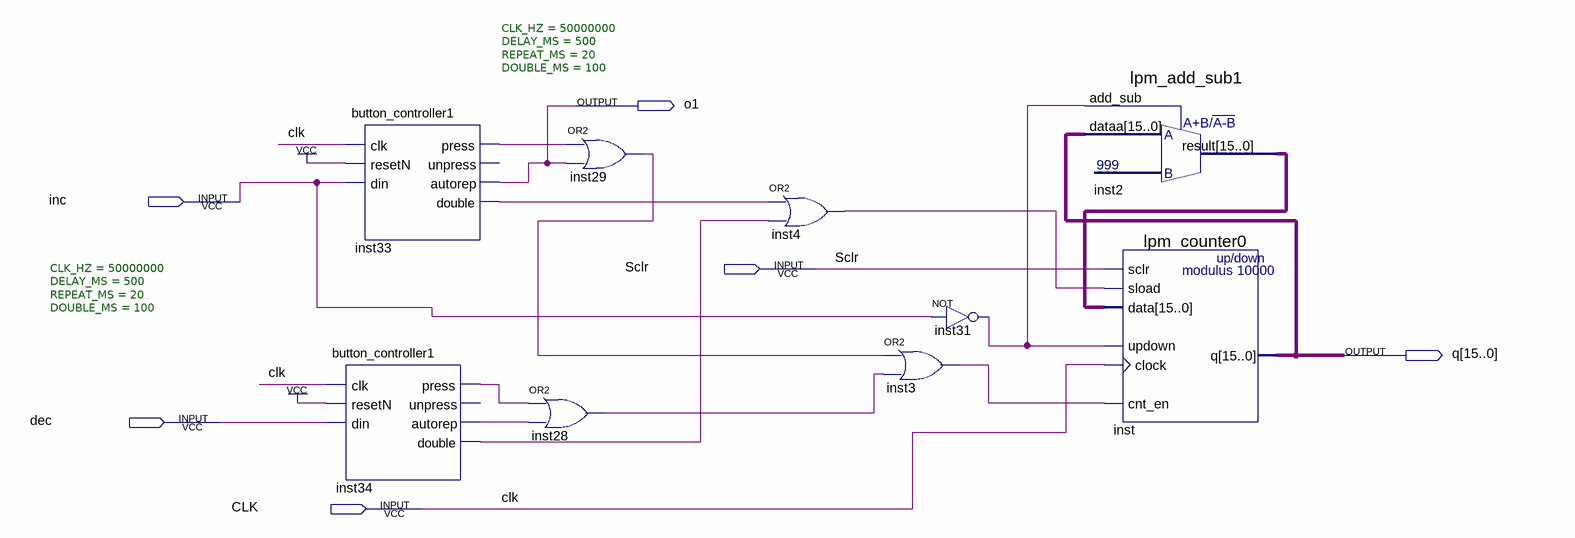
[diagram p0: schematic sheet]
// Quartus schematic increment.bdf as structural Verilog: 9 symbols, 6 pins
module increment (
  input  inc,
  input  Sclr,
  input  dec,
  input  CLK,
  output o1,
  output [15:0] q
);

  wire inst3_out, inst4_out, inst28_out, inst29_out, inst31_out, inst33_double, inst33_press, inst34_autorep,
       inst34_double, inst34_press;
  wire [15:0] inst2_result;

  button_controller1 #(.CLK_HZ(50000000), .DELAY_MS(500), .REPEAT_MS(20), .DOUBLE_MS(100)) inst33 (
    .clk(CLK), .resetN(1'b1), .din(inc), .press(inst33_press), .autorep(o1), .double(inst33_double));  // open: unpress
  button_controller1 #(.CLK_HZ(50000000), .DELAY_MS(500), .REPEAT_MS(20), .DOUBLE_MS(100)) inst34 (
    .clk(CLK), .resetN(1'b1), .din(dec), .press(inst34_press), .autorep(inst34_autorep),
    .double(inst34_double));  // open: unpress
  or inst29 (inst29_out, inst33_press, o1);
  or inst28 (inst28_out, inst34_press, inst34_autorep);
  or inst4 (inst4_out, inst33_double, inst34_double);
  or inst3 (inst3_out, inst29_out, inst28_out);
  not inst31 (inst31_out, inc);
  lpm_add_sub1 inst2 (.dataa(q), .add_sub(inst31_out), .result(inst2_result));
  lpm_counter0 inst (
    .sclr(Sclr), .sload(inst4_out), .data(inst2_result), .updown(inst31_out), .clock(CLK),
    .cnt_en(inst3_out), .q(q));
endmodule
